# Altium project EncoderArm.PrjPcb
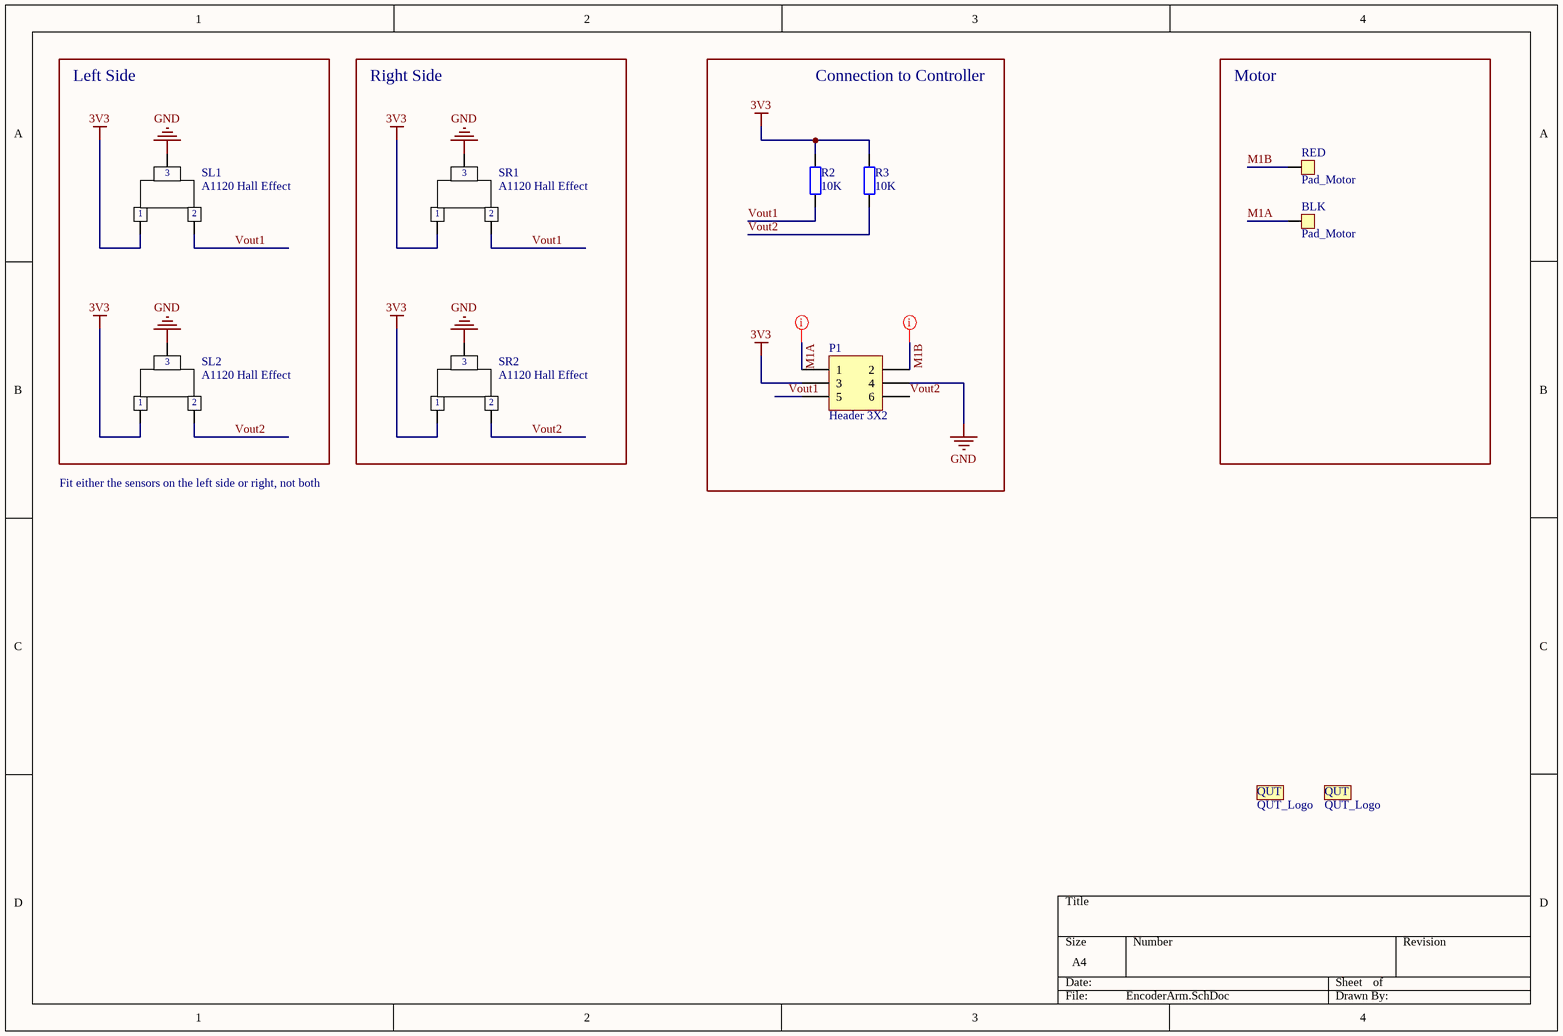
[diagram p0: EncoderArm.SchDoc]
1 sheet, 11 parts. Net scope: global (net labels, ports and power ports of the same name join across sheets).
Board file: EncoderArm.PcbDoc

## Sheet EncoderArm.SchDoc
size A4; PageSetup: Record=PageOptions|CenterHorizontal=True|CenterVertical=True|PrintScale=1.39|XCorrection=1.00|YCorrection=1.00|PrintKind=1|BorderSize=5000000|LeftOffset=0|BottomOffset=0|Orientation=2|PaperLength=1000|PaperWidth=1000|Scale=100|PaperSource=7|PrintQuality=600|MediaType=1|DitherType=10|PrintScaleMode=1|PaperKind=A3 (297 x 420mm)|PaperIndex=8

### Parts
BLK  Pad_Motor  [Pads_Motor]
LG1  QUT_Logo  [QUT_Logo]  (no BOM)
LG2  QUT_Logo  [QUT_Logo]  (no BOM)
P1  Header 3X2  [HDR2X3]
R2  value 10K  [6-0805_M]  (hidden comment: Res2)
R3  value 10K  [6-0805_M]  (hidden comment: Res2)
RED  Pad_Motor  [Pads_Motor]
SL1  A1120 Hall Effect  [SOT23-3N]
SL2  A1120 Hall Effect  [SOT23-3N]
SR1  A1120 Hall Effect  [SOT23-3N]
SR2  A1120 Hall Effect  [SOT23-3N]

### Blocks framed on the sheet
Left Side: SL1 SL2
Right Side: SR1 SR2
Connection to Controller: P1 R2 R3
Motor: BLK RED

### Nets
3V3: P1.3 R2.2 R3.2 SL1.1 SL2.1 SR1.1 SR2.1
GND: P1.4 SL1.3 SL2.3 SR1.3 SR2.3
M1A: BLK.0 P1.1
M1B: P1.2 RED.0
Vout1: P1.5 R2.1 SL1.2 SR1.2
Vout2: P1.6 R3.1 SL2.2 SR2.2

### Layout directives
net class Power: M1A, M1B

### Notes on the sheet
- Fit either the sensors on the left side or right, not both
- (in symbol QUT_Logo) QUT

### Library data of the parts
P1 = Header 3X2: Header, 3-Pin, Dual row; LatestRevisionDate: 17-Jul-2002; LatestRevisionNote: Re-released for DXP Platform.; Publisher: Altium Limited
R2 R3 = Res2: Resistor; Published: 8-Jun-2000; LatestRevisionDate: 17-Jul-2002; LatestRevisionNote: Re-released for DXP Platform.; PackageReference: AXIAL-0.4; Publisher: Altium Limited
SL1 SL2 SR1 SR2 = FT_SOT23-3